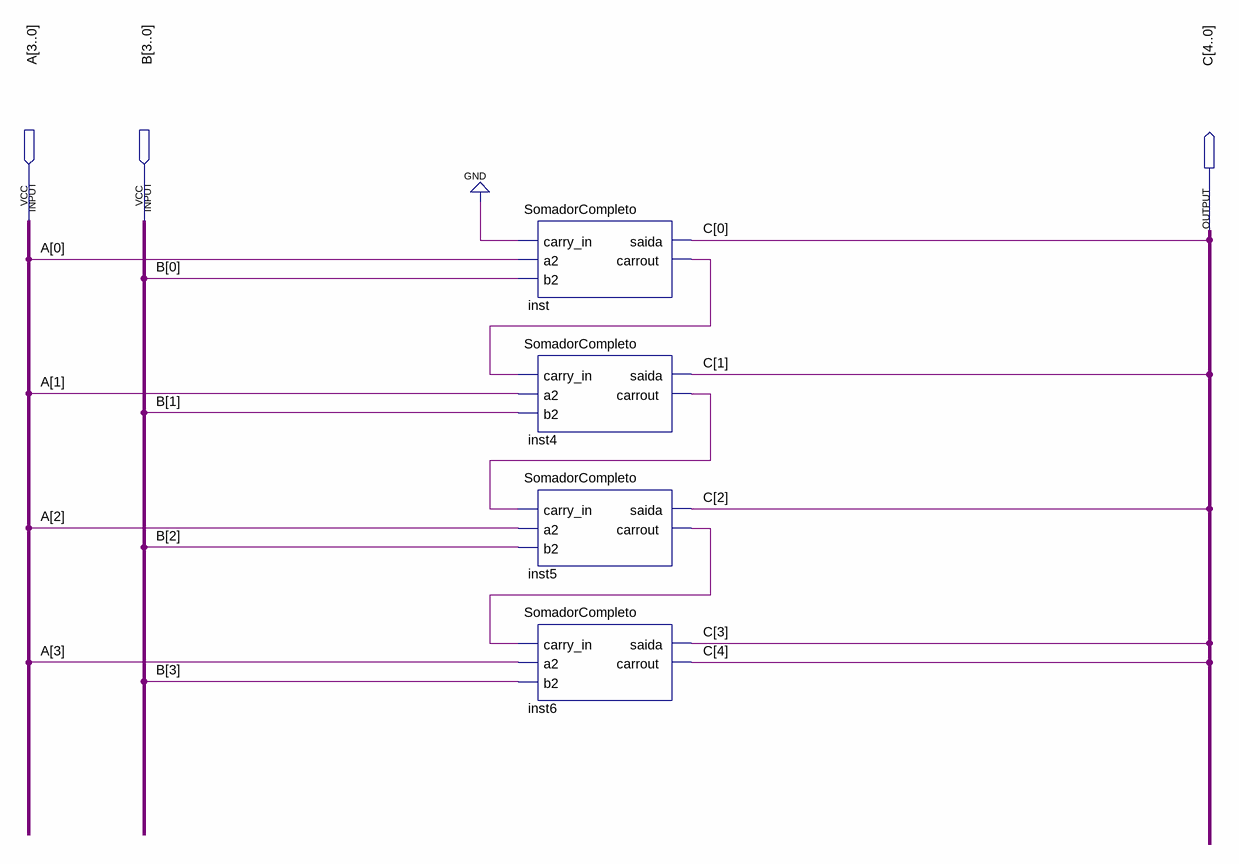
[diagram p0: schematic sheet]
// Quartus schematic SomaTotal.bdf as structural Verilog: 4 symbols, 3 pins
module SomaTotal (
  input  [3:0] A,
  input  [3:0] B,
  output [4:0] C
);

  wire inst4_carrout, inst5_carrout, inst_carrout;

  SomadorCompleto inst (.carry_in(1'b0), .a2(A[0]), .b2(B[0]), .saida(C[0]), .carrout(inst_carrout));
  SomadorCompleto inst4 (.carry_in(inst_carrout), .a2(A[1]), .b2(B[1]), .saida(C[1]), .carrout(inst4_carrout));
  SomadorCompleto inst5 (.carry_in(inst4_carrout), .a2(A[2]), .b2(B[2]), .saida(C[2]), .carrout(inst5_carrout));
  SomadorCompleto inst6 (.carry_in(inst5_carrout), .a2(A[3]), .b2(B[3]), .saida(C[3]), .carrout(C[4]));
endmodule
